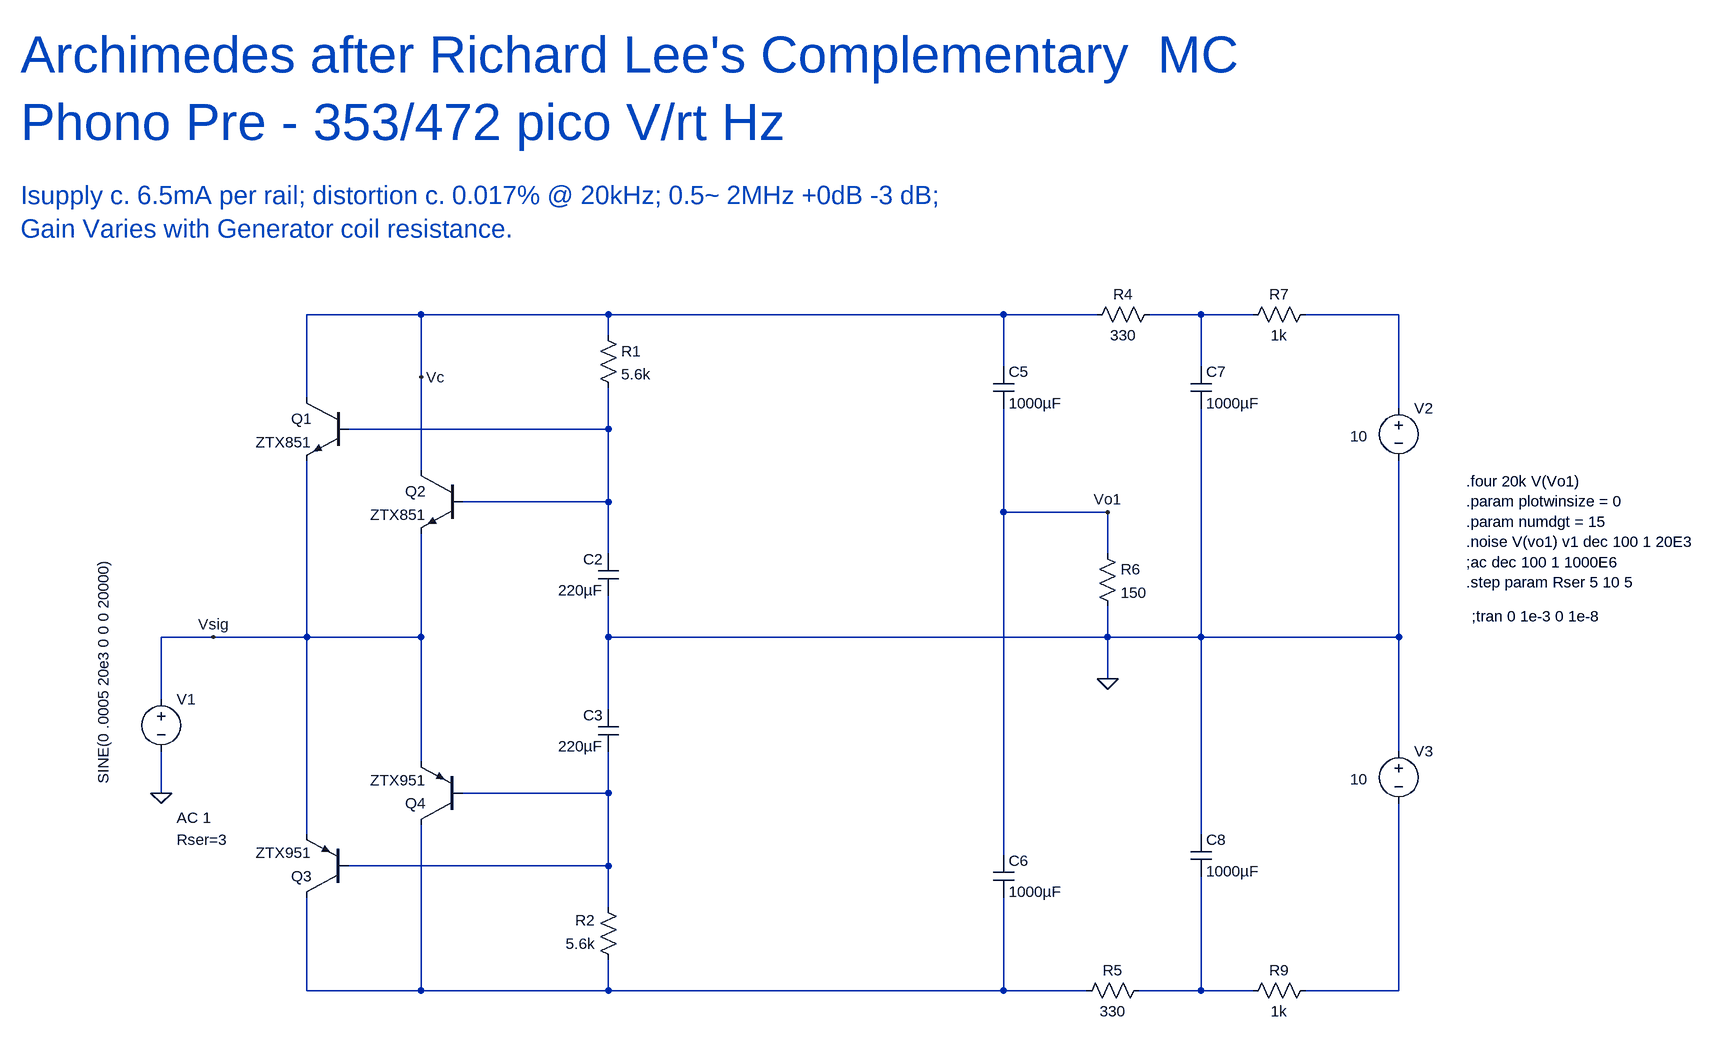
[diagram p0: schematic Archimedes.asc]
Archimedes.asc, the LTspice schematic file:
Version 4
SHEET 1 2900 680
WIRE -160 -528 -336 -528
WIRE 128 -528 -160 -528
WIRE 736 -528 128 -528
WIRE 880 -528 736 -528
WIRE 1040 -528 960 -528
WIRE 1120 -528 1040 -528
WIRE 1344 -528 1200 -528
WIRE 128 -496 128 -528
WIRE 736 -448 736 -528
WIRE 1040 -448 1040 -528
WIRE -160 -432 -160 -528
WIRE -336 -400 -336 -528
WIRE 1344 -384 1344 -528
WIRE 128 -352 128 -416
WIRE 128 -352 -272 -352
WIRE -160 -288 -160 -432
WIRE 128 -240 128 -352
WIRE 128 -240 -96 -240
WIRE 736 -224 736 -384
WIRE 896 -224 736 -224
WIRE 128 -160 128 -240
WIRE 896 -160 896 -224
WIRE -480 -32 -560 -32
WIRE -336 -32 -336 -304
WIRE -336 -32 -480 -32
WIRE -160 -32 -160 -192
WIRE -160 -32 -336 -32
WIRE 128 -32 128 -96
WIRE 896 -32 896 -80
WIRE 896 -32 128 -32
WIRE 1040 -32 1040 -384
WIRE 1040 -32 896 -32
WIRE 1344 -32 1344 -304
WIRE 1344 -32 1040 -32
WIRE 896 32 896 -32
WIRE -560 64 -560 -32
WIRE 128 80 128 -32
WIRE 1344 144 1344 -32
WIRE -160 160 -160 -32
WIRE -560 208 -560 144
WIRE 128 208 128 144
WIRE 128 208 -96 208
WIRE -336 272 -336 -32
WIRE 1040 272 1040 -32
WIRE 736 304 736 -224
WIRE 128 320 128 208
WIRE 128 320 -272 320
WIRE 128 384 128 320
WIRE -336 512 -336 368
WIRE -160 512 -160 256
WIRE -160 512 -336 512
WIRE 128 512 128 464
WIRE 128 512 -160 512
WIRE 736 512 736 368
WIRE 736 512 128 512
WIRE 864 512 736 512
WIRE 1040 512 1040 336
WIRE 1040 512 944 512
WIRE 1120 512 1040 512
WIRE 1344 512 1344 224
WIRE 1344 512 1200 512
FLAG -560 208 0
FLAG 896 32 0
FLAG 896 -224 Vo1
FLAG -160 -432 Vc
FLAG -480 -32 Vsig
SYMBOL voltage -560 48 R0
WINDOW 3 -89 -203 VRight 2
WINDOW 123 24 198 Left 2
WINDOW 39 24 232 Left 2
SYMATTR Value SINE(0 .0005 20e3 0 0 0 20000)
SYMATTR Value2 AC 1
SYMATTR SpiceLine Rser=3
SYMATTR InstName V1
SYMBOL voltage 1344 -400 R0
WINDOW 3 -75 59 Left 2
WINDOW 123 -75 93 Left 2
WINDOW 39 0 0 Left 2
SYMATTR Value 10
SYMATTR InstName V2
SYMBOL npn -96 -288 M0
SYMATTR InstName Q2
SYMATTR Value ZTX851
SYMBOL pnp -96 256 R180
SYMATTR InstName Q4
SYMATTR Value ZTX951
SYMBOL res 112 -512 R0
SYMATTR InstName R1
SYMATTR Value 5.6k
SYMBOL res 144 480 R180
WINDOW 0 36 76 Left 2
WINDOW 3 36 40 Left 2
SYMATTR InstName R2
SYMATTR Value 5.6k
SYMBOL cap 144 -96 R180
WINDOW 0 24 56 Left 2
WINDOW 3 24 8 Left 2
SYMATTR InstName C2
SYMATTR Value 220µF
SYMBOL cap 144 144 R180
WINDOW 0 24 56 Left 2
WINDOW 3 24 8 Left 2
SYMATTR InstName C3
SYMATTR Value 220µF
SYMBOL res 976 -544 R90
WINDOW 0 0 56 VBottom 2
WINDOW 3 32 56 VTop 2
SYMATTR InstName R4
SYMATTR Value 330
SYMBOL res 960 496 R90
WINDOW 0 0 56 VBottom 2
WINDOW 3 32 56 VTop 2
SYMATTR InstName R5
SYMATTR Value 330
SYMBOL cap 720 -448 R0
SYMATTR InstName C5
SYMATTR Value 1000µF
SYMBOL cap 720 304 R0
SYMATTR InstName C6
SYMATTR Value 1000µF
SYMBOL res 880 -176 R0
SYMATTR InstName R6
SYMATTR Value 150
SYMBOL res 1216 -544 R90
WINDOW 0 0 56 VBottom 2
WINDOW 3 32 56 VTop 2
SYMATTR InstName R7
SYMATTR Value 1k
SYMBOL res 1216 496 R90
WINDOW 0 0 56 VBottom 2
WINDOW 3 32 56 VTop 2
SYMATTR InstName R9
SYMATTR Value 1k
SYMBOL cap 1024 -448 R0
SYMATTR InstName C7
SYMATTR Value 1000µF
SYMBOL cap 1024 272 R0
SYMATTR InstName C8
SYMATTR Value 1000µF
SYMBOL voltage 1344 128 R0
WINDOW 3 -75 59 Left 2
WINDOW 123 24 130 Left 2
WINDOW 39 0 0 Left 2
SYMATTR Value 10
SYMATTR InstName V3
SYMBOL npn -272 -400 M0
SYMATTR InstName Q1
SYMATTR Value ZTX851
SYMBOL pnp -272 368 R180
SYMATTR InstName Q3
SYMATTR Value ZTX951
TEXT 1456 -64 Left 2 !;tran 0 1e-3 0 1e-8
TEXT 1448 -272 Left 2 !.four 20k V(Vo1)\n.param plotwinsize = 0\n.param numdgt = 15\n.noise V(vo1) v1 dec 100 1 20E3\n;ac dec 100 1 1000E6\n.step param Rser 5 10 5
TEXT -776 -928 Left 6 ;Archimedes after Richard Lee's Complementary  MC \nPhono Pre - 353/472 pico V/rt Hz
TEXT -776 -712 Left 4 ;Isupply c. 6.5mA per rail; distortion c. 0.017% @ 20kHz; 0.5~ 2MHz +0dB -3 dB; \nGain Varies with Generator coil resistance.

The netlist it stands for:
* Archimedes.asc
V1 Vsig 0 SINE(0 .0005 20e3 0 0 0 20000) AC 1 Rser=3
V2 N002 0 10
Q2 Vc N003 Vsig 0 ZTX851
Q4 N005 N004 Vsig 0 ZTX951
R1 Vc N003 5.6k
R2 N005 N004 5.6k
C2 0 N003 220µF
C3 N004 0 220µF
R4 N001 Vc 330
R5 N006 N005 330
C5 Vc Vo1 1000µF
C6 Vo1 N005 1000µF
R6 Vo1 0 150
R7 N002 N001 1k
R9 N007 N006 1k
C7 N001 0 1000µF
C8 0 N006 1000µF
V3 0 N007 10
Q1 Vc N003 Vsig 0 ZTX851
Q3 N005 N004 Vsig 0 ZTX951
.model NPN NPN
.model PNP PNP
.lib standard.bjt
;tran 0 1e-3 0 1e-8
.four 20k V(Vo1)
.param plotwinsize = 0
.param numdgt = 15
.noise V(vo1) v1 dec 100 1 20E3
;ac dec 100 1 1000E6
.step param Rser 5 10 5
* Archimedes after Richard Lee's Complementary  MC
* Phono Pre - 353/472 pico V/rt Hz
* Isupply c. 6.5mA per rail; distortion c. 0.017% @ 20kHz; 0.5~ 2MHz +0dB -3 dB;
* Gain Varies with Generator coil resistance.
.backanno
.end